# Altium schematic sheet CD74HC4067_MUX_5.SchDoc
size A
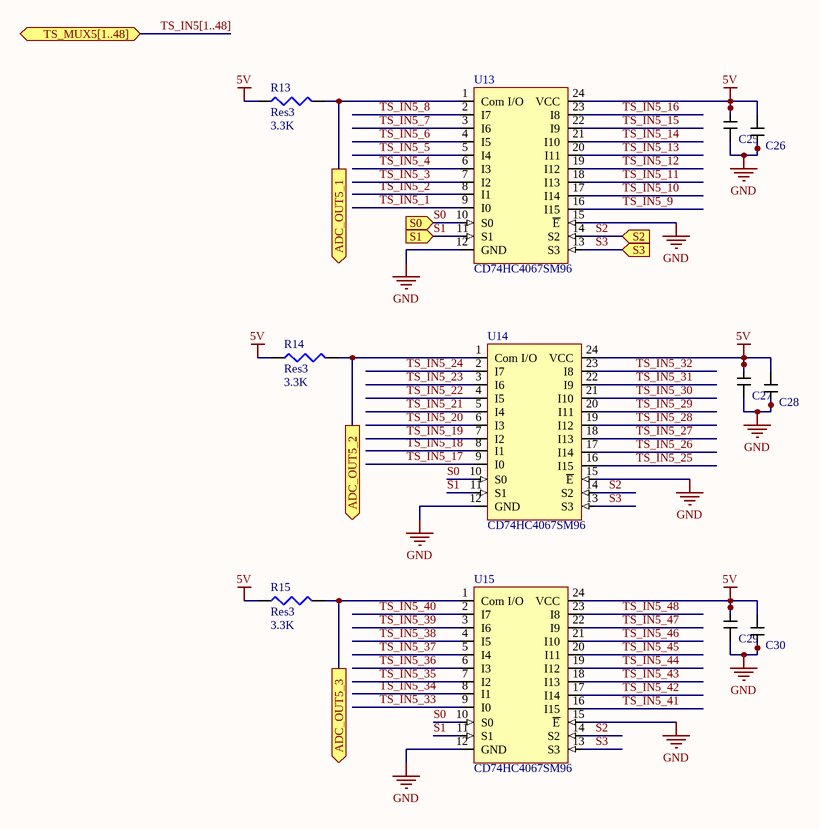
[diagram p0: CD74HC4067_MUX_5.SchDoc]

## Parts
C25  0.1uF Cap  [CAPC1608X09M]  (value not drawn)
C26  1uF Samsung Cap  [CAPC1608X09M]  (value not drawn)
C27  0.1uF Cap  [CAPC1608X09M]  (value not drawn)
C28  1uF Samsung Cap  [CAPC1608X09M]  (value not drawn)
C29  0.1uF Cap  [CAPC1608X09M]  (value not drawn)
C30  1uF Samsung Cap  [CAPC1608X09M]  (value not drawn)
R13  Res3  value 3.3K  [J1-0603]
R14  Res3  value 3.3K  [J1-0603]
R15  Res3  value 3.3K  [J1-0603]
U13  CD74HC4067SM96  [SOIC-24_MUX]
U14  CD74HC4067SM96  [SOIC-24_MUX]
U15  CD74HC4067SM96  [SOIC-24_MUX]

## Ports
ADC_OUT5_1 (out), ADC_OUT5_2 (out), ADC_OUT5_3 (out), S0 (in), S1 (in), S2 (in), S3 (in), TS_MUX5[1..48] (bidir)

## Nets
5V: C25.2 C26.2 C27.2 C28.2 C29.2 C30.2 R13.1 R14.1 R15.1 U13.24(VCC) U14.24(VCC) U15.24(VCC)
GND: C25.1 C26.1 C27.1 C28.1 C29.1 C30.1 U13.12(GND) U13.15(~{E}) U14.12(GND) U14.15(~{E}) U15.12(GND) U15.15(~{E})
ADC_OUT5_1: R13.2 U13.1(Com_I/O) ; port ADC_OUT5_1
ADC_OUT5_2: R14.2 U14.1(Com_I/O) ; port ADC_OUT5_2
ADC_OUT5_3: R15.2 U15.1(Com_I/O) ; port ADC_OUT5_3
S0: U13.10(S0) U14.10(S0) U15.10(S0) ; port S0
S1: U13.11(S1) U14.11(S1) U15.11(S1) ; port S1
S2: U13.14(S2) U14.14(S2) U15.14(S2) ; port S2
S3: U13.13(S3) U14.13(S3) U15.13(S3) ; port S3
TS_IN5_1: U13.9(I0)
TS_IN5_2: U13.8(I1)
TS_IN5_3: U13.7(I2)
TS_IN5_4: U13.6(I3)
TS_IN5_5: U13.5(I4)
TS_IN5_6: U13.4(I5)
TS_IN5_7: U13.3(I6)
TS_IN5_8: U13.2(I7)
TS_IN5_9: U13.16(I15)
TS_IN5_10: U13.17(I14)
TS_IN5_11: U13.18(I13)
TS_IN5_12: U13.19(I12)
TS_IN5_13: U13.20(I11)
TS_IN5_14: U13.21(I10)
TS_IN5_15: U13.22(I9)
TS_IN5_16: U13.23(I8)
TS_IN5_17: U14.9(I0)
TS_IN5_18: U14.8(I1)
TS_IN5_19: U14.7(I2)
TS_IN5_20: U14.6(I3)
TS_IN5_21: U14.5(I4)
TS_IN5_22: U14.4(I5)
TS_IN5_23: U14.3(I6)
TS_IN5_24: U14.2(I7)
TS_IN5_25: U14.16(I15)
TS_IN5_26: U14.17(I14)
TS_IN5_27: U14.18(I13)
TS_IN5_28: U14.19(I12)
TS_IN5_29: U14.20(I11)
TS_IN5_30: U14.21(I10)
TS_IN5_31: U14.22(I9)
TS_IN5_32: U14.23(I8)
TS_IN5_33: U15.9(I0)
TS_IN5_34: U15.8(I1)
TS_IN5_35: U15.7(I2)
TS_IN5_36: U15.6(I3)
TS_IN5_37: U15.5(I4)
TS_IN5_38: U15.4(I5)
TS_IN5_39: U15.3(I6)
TS_IN5_40: U15.2(I7)
TS_IN5_41: U15.16(I15)
TS_IN5_42: U15.17(I14)
TS_IN5_43: U15.18(I13)
TS_IN5_44: U15.19(I12)
TS_IN5_45: U15.20(I11)
TS_IN5_46: U15.21(I10)
TS_IN5_47: U15.22(I9)
TS_IN5_48: U15.23(I8)

## Buses and harness runs
bus TS_IN5[1..48] = port TS_MUX5[1..48]

## Library data of the parts
C25 C27 C29 = 0.1uF Cap: C0603C101K8GAC7867 Kemet Capacitor; Supplier 1: Digi-Key; Supplier Part Number 1: 399-14477-1-ND
R13-R15 = Res3: Resistor; Published: 8-Jun-2000; LatestRevisionDate: 29-May-2009; LatestRevisionNote: IPC-7351 Footprint Added.; PackageReference: J1-0603; Publisher: Altium Limited; PackageDescription: Chip Resistor
C26 C28 C30 = 1uF Samsung Cap: Supplier 1: Digi-Key; Supplier Part Number 1: 1276-1946-1-ND
U13-U15 = CD74HC4067SM96: Supplier Part Number 1: 05B6161; Supplier 1: Newark